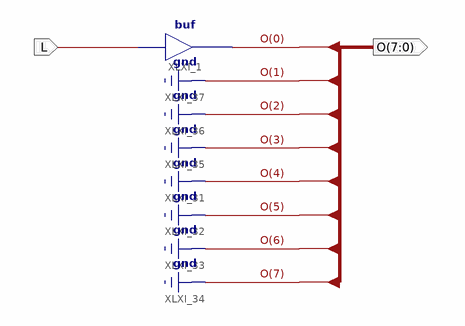
[diagram p0: schematic sheet 1]
// Xilinx ISE schematic resize1x8x0l.sch (spartan6) as structural Verilog: 1 symbols, 2 ports
module resize1x8x0l (
  input  L,
  output [7:0] O
);

  buf XLXI_1 (O[0], L);

  assign O[7:1] = {7{1'b0}};
endmodule
